# Altium schematic sheet PSU_LP385_ADJ1.SchDoc
size A4
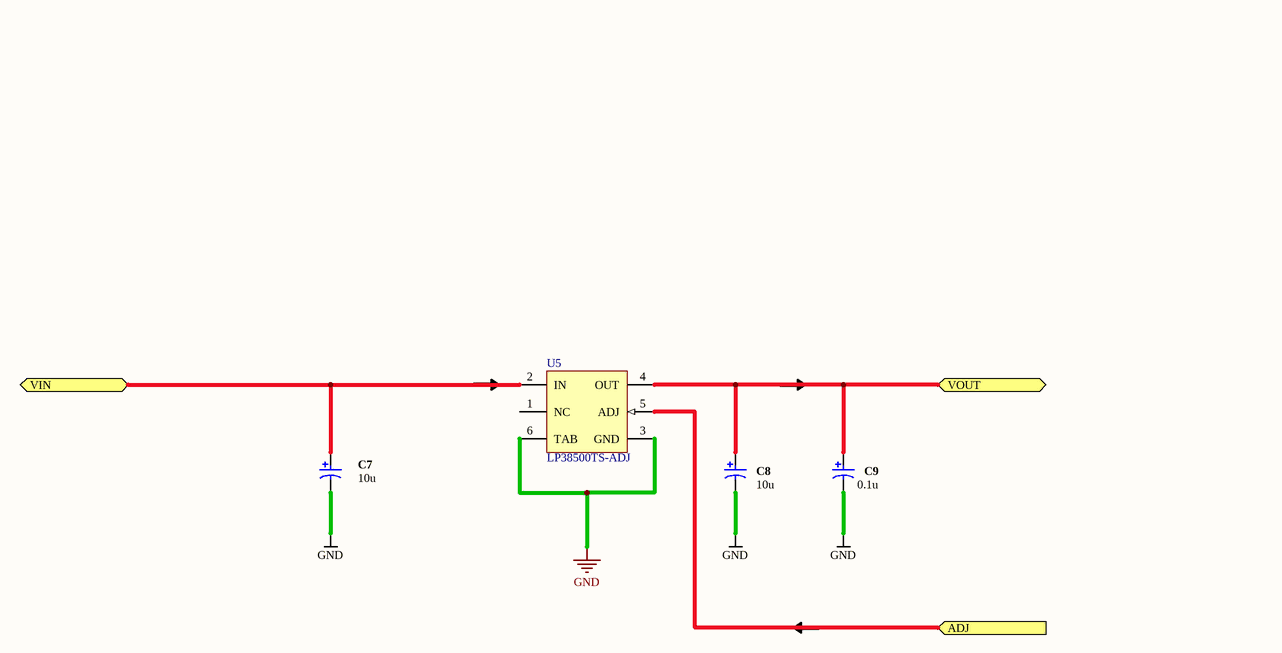
[diagram p0: PSU_LP385_ADJ1.SchDoc]

## Parts
C7  10u  [CAPC3528-STAR]
C8  10u  [CAPC3528-STAR]
C9  0.1u  [CAPC7343-STAR]
U5  LP38500TS-ADJ  [TS5B_M]

## Ports
ADJ (in), VIN, VOUT

## Nets
GND: C7.2 C8.2 C9.2 U5.3(GND) U5.6(TAB)
ADJ: U5.5(ADJ) ; port ADJ
VIN: C7.1 U5.2(IN) ; port VIN
VOUT: C8.1 C9.1 U5.4(OUT) ; port VOUT

Not connected (* = marked no-connect by the designer): U5 1(NC)

## Library data of the parts
C7 C8 = D-101-0007: Capacitor, Tantalum, 10uF 10% 20V MCCT-B (3528); Polarity: Polarized; Category: Capacitor; Capacitance: 10 uF; Mounting Technology: Surface Mount; Rated Voltage: 20 V; Status: Production; Technology: Tantalum; Tolerance: 10 %
C9 = D-101-0088: Capacitor, Tantalum, 220uF 10% 10V MCCT-D (7343-31); Polarity: Polarized; Category: Capacitor; Capacitance: 220 uF; Mounting Technology: Surface Mount; Rated Voltage: 10 V; Status: Unreleased; Technology: Tantalum; Tolerance: 10 %
U5 = LP38500TS-ADJ: 1.5A FlexCap Low Dropout Linear Regulator for 2.7V to 5.5V Inputs, 5-pin TO-263; Manufacturer: National Semiconductor; PackageTopMarking: NSUZXYTTE#*LP38500*TS-ADJ; PowerWise: N; CompType: LDO IC; High-Reliability: Y; DatasheetVersion: May-2008; PackageVersion: revD, Apr-2005; PackageReference: TS5B; PackageDescription: TO-263, Molded, .400 x .390 x .180in, 5 Lead, .067in Pitch, Surface Mount; PartNumber: LP38500TS-ADJ; RoHS: Y; PinCount: 5; Code_JEDEC: MO-169-AB; ComponentLink1Description: Manufacturer URL; ComponentLink1URL: http://www.national.com/; ComponentLink2Description: LP38500-ADJ Datasheet; ComponentLink2URL: http://www.national.com/ds/LP/LP38500-ADJ.pdf; ComponentLink3Description: LP38500-ADJ Web Page; ComponentLink3URL: http://www.national.com/pf/LP/LP38500-ADJ.html; ComponentLink4Description: TS5B Package Page; ComponentLink4URL: http://www.national.com/packaging/folders/ts5b.html